# EAGLE schematic emmcdisable (EAGLE 9.3.0)
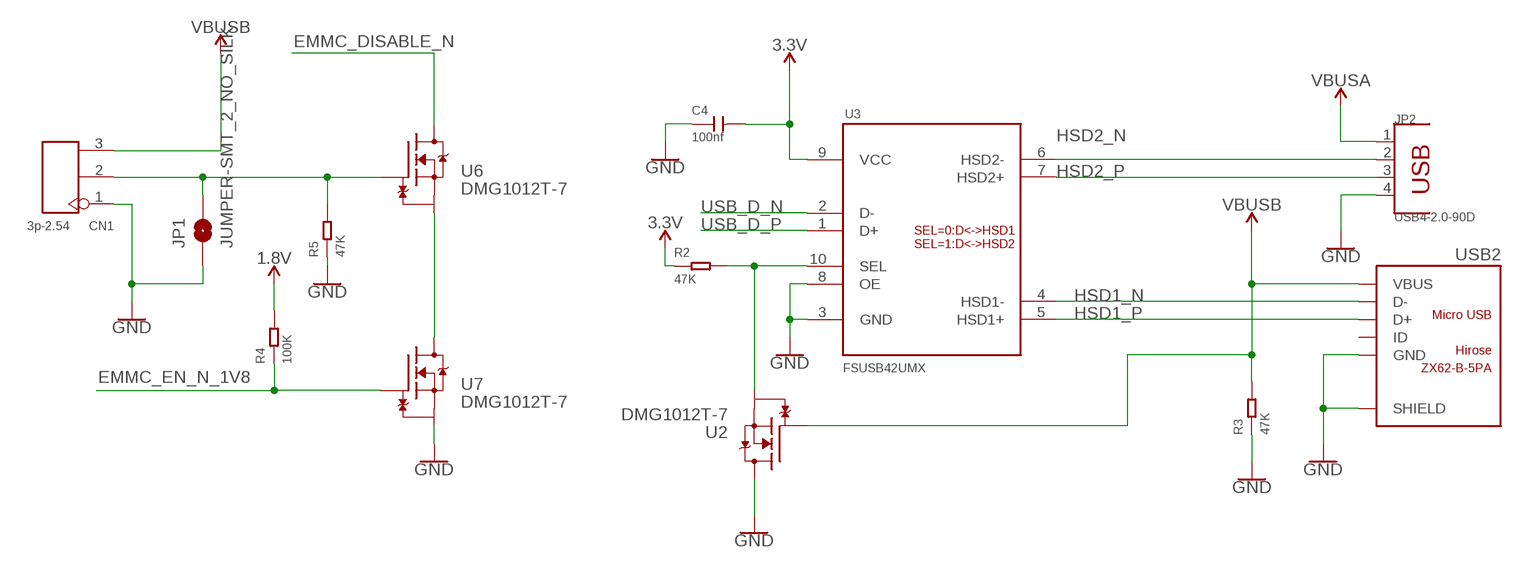
[diagram p0: schematic, sheet 1]

## Parts
C4  100nf  CERAMIC-100NF-25V-10%-X7R(0402)  [C0402K]
CN1  3p-2.54  DIP-BLACK-MALE-HEADER-VERT(3P-2.54)  [H3-2.54]
JP1  JUMPER-SMT_2_NO_SILK  [SMT-JUMPER_2_NO_SILK]
JP2  USB4-2.0-90D  DIP-USB-A-TYPE-FMAL(4+2P-2.0-90D)  [USB4+2P-2.0-90D]
R2  47K  SMD-RES-47K-5%-1/16W(0402)  [R0402]
R3  47K  SMD-RES-47K-5%-1/16W(0402)  [R0402]
R4  100K  SMD-RES-100K-1%-1/16W(0402)  [R0402]
R5  47K  SMD-RES-47K-5%-1/16W(0402)  [R0402]
U2  DMG1012T-7  [SOT50P175X90-3N]
U3  FSUSB42UMX  [QFN40P140X180X55-10]
U6  DMG1012T-7  [SOT50P175X90-3N]
U7  DMG1012T-7  [SOT50P175X90-3N]
USB2  ZX62-B-5PA  MICRO-USB-SMD(ZX62-B-5PA)  [MICRO-USB5+6P-SMD-0.65-AB]

## Nets
1.8V [pwr]: R4.2
3.3V [pwr]: C4.2 R2.1 U3.9(VCC)
EMMC_DISABLE_N: U6.D
EMMC_EN_N_1V8: R4.1 U7.G
GND [pwr]: C4.1 CN1.1 JP1.1 JP2.4 R3.1 R5.1 U2.D U3.3(GND) U3.8(OE) U7.S USB2.5(GND) USB2.P1(SHIELD) USB2.P2(SHIELD) USB2.P3(SHIELD) USB2.P4(SHIELD) USB2.P5(SHIELD) USB2.P6(SHIELD)
HSD1_N: U3.4(HSD1-) USB2.2(D-)
HSD1_P: U3.5(HSD1+) USB2.3(D+)
HSD2_N: JP2.2 U3.6(HSD2-)
HSD2_P: JP2.3 U3.7(HSD2+)
N$3: CN1.2 JP1.2 R5.2 U6.G
N$4: U6.S U7.D
SEL: R2.2 U2.S U3.10(SEL)
USB_D_N [diff pairs]: U3.2(D-)
USB_D_P [diff pairs]: U3.1(D+)
VBUSA: JP2.1
VBUSB [pwr]: CN1.3 R3.2 U2.G USB2.1(VBUS)
Unconnected: JP2.SG1(GND) JP2.SG2(GND) USB2.4(ID)

## Library data of the parts
C4 = RPI_CAM:CERAMIC-100NF-25V-10%-X7R(0402): 302010024; MPN: CC0402KRX7R8BB104
CN1 = RPI_CAM:DIP-BLACK-MALE-HEADER-VERT(3P-2.54): 320020079
JP1 = RPI_CAM:JUMPER-SMT_2_NO: Normally open jumper This jumper has two pads in close proximity to each other. Apply solder to close the connection. Round pads are easier to solder for beginners, but are a lot larger. SparkFun Product that uses the round pads: SparkFun EL Sequencer <https://www.sparkfun.com/products/12781>
JP2 = RPI_CAM:DIP-USB-A-TYPE-FMAL(4+2P-2.0-90D): 320010007
R2 R3 R5 = RPI_CAM:SMD-RES-47K-5%-1/16W(0402): 301010005; MPN: RC0402JR-0747KL
R4 = RPI_CAM:SMD-RES-100K-1%-1/16W(0402): 301010456; MPN: RC0402FR-07100KL
U2 U6 U7 = RPI_CAM:DMG1012T-7: DMG1012T Series 20 V 400 mOhm N-Channel Enhancement Mode Mosfet - SOT-523
U3 = RPI_CAM:FSUSB42UMX
USB2 = RPI_CAM:MICRO-USB-SMD(ZX62-B-5PA): 320010005; MPN: ZX62-B-5PA

## Net classes
1 diff pairs: width 0.203 mm
2 pwr: width 0.305 mm